# Altium schematic sheet Audio.SchDoc
size A
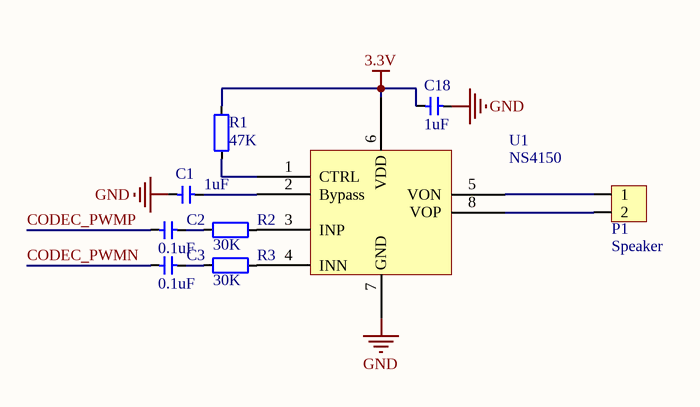
[diagram p0: Audio.SchDoc]

## Parts
C1  value 1uF  [CAP_0402]  (hidden comment: Cap_0402)
C2  value 0.1uF  [CAP_0402]  (hidden comment: Cap_0402)
C3  value 0.1uF  [CAP_0402]  (hidden comment: Cap_0402)
C18  value 1uF  [CAP_0402]  (hidden comment: Cap_0402)
P1  Speaker  [HDR1X2_2.54_180]
R1  value 47K  [RES_0402]  (hidden comment: Res_0402)
R2  value 30K  [RES_0402]  (hidden comment: Res_0402)
R3  value 30K  [RES_0402]  (hidden comment: Res_0402)
U1  NS4150  [SOP_E150_8]

## Nets
3.3V: C18.2 R1.2 U1.6(VDD)
GND: C1.1 C18.1
CODEC_PWMN: C3.1
CODEC_PWMP: C2.1
NetC1_2: C1.2 U1.2(Bypass)
NetC2_2: C2.2 R2.2
NetC3_2: C3.2 R3.2
NetP1_1: P1.1 U1.5(VON)
NetP1_2: P1.2 U1.8(VOP)
NetR1_1: R1.1 U1.1(CTRL)
NetR2_1: R2.1 U1.3(INP)
NetR3_1: R3.1 U1.4(INN)

Not connected (* = marked no-connect by the designer): U1 7(GND)

## Notes on the sheet
- Labels drawn without touching a wire or pin: GND

## Library data of the parts
C1-C3 C18 = Cap_0402: Capacitor
P1 = HDR1x2_2.54: Header
R1-R3 = Res_0402: Resistor
U1 = NS4150: D Class Audio Amp